# Altium project Ant_Robot_Controller.PrjPCB
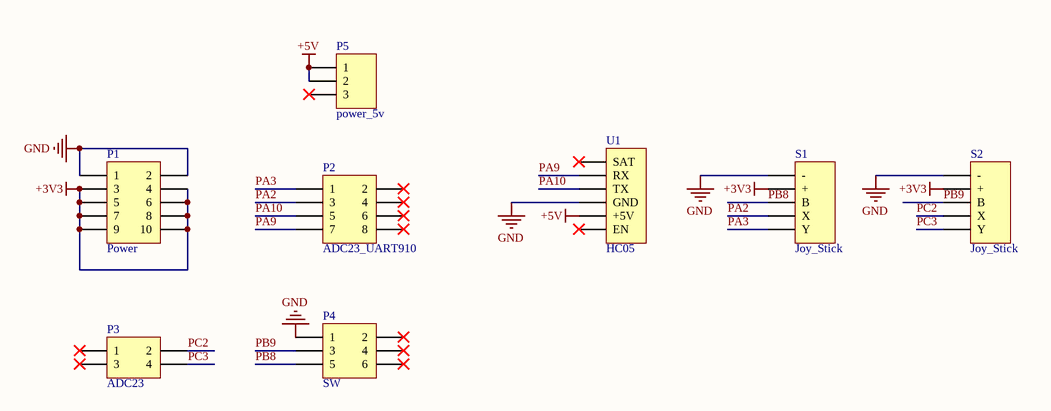
[diagram p0: Ant_Robot_Controller.SchDoc]
1 sheet, 8 parts. Net scope: global (net labels, ports and power ports of the same name join across sheets).
Board file: Ant_Robot_Controller.PcbDoc

## Sheet Ant_Robot_Controller.SchDoc
size A3

### Parts
P1  Power  [HDR2X5]
P2  ADC23_UART910  [HDR2X4]
P3  ADC23  [HDR2X2]
P4  SW  [HDR2X3]
P5  power_5v  [HDR1X3]
S1  Joy_Stick  [HDR1X5]
S2  Joy_Stick  [HDR1X5]
U1  HC05  [HDR1X6]

### Nets
+3V3: P1.3 P1.4 P1.5 P1.6 P1.7 P1.8 P1.9 P1.10 S1.2(+) S2.2(+)
+5V: P5.1 P5.2 U1.5(+5V)
GND: P1.1 P1.2 P4.1 S1.1(-) S2.1(-) U1.4(GND)
PA2: P2.3 S1.4(X)
PA3: P2.1 S1.5(Y)
PA9: P2.7 U1.2(RX)
PA10: P2.5 U1.3(TX)
PB8: P4.5 S1.3(B)
PB9: P4.3 S2.3(B)
PC2: P3.2 S2.4(X)
PC3: P3.4 S2.5(Y)

Not connected (* = marked no-connect by the designer): P2 2* 4* 6* 8*; P3 1* 3*; P4 2* 4* 6*; P5 3*; U1 1(SAT)* 6(EN)*

### Library data of the parts
P1 = Header 5X2: Header, 5-Pin, Dual row; LatestRevisionDate: 17-Jul-2002; LatestRevisionNote: Re-released for DXP Platform.; Publisher: Altium Limited
P2 = Header 4X2: Header, 4-Pin, Dual row; LatestRevisionDate: 17-Jul-2002; LatestRevisionNote: Re-released for DXP Platform.; Publisher: Altium Limited
P3 = Header 2X2: Header, 2-Pin, Dual row; LatestRevisionDate: 17-Jul-2002; LatestRevisionNote: Re-released for DXP Platform.; Publisher: Altium Limited
P4 = Header 3X2: Header, 3-Pin, Dual row; LatestRevisionDate: 17-Jul-2002; LatestRevisionNote: Re-released for DXP Platform.; Publisher: Altium Limited
P5 = Header 3: Header, 3-Pin; LatestRevisionDate: 17-Jul-2002; LatestRevisionNote: Re-released for DXP Platform.; Publisher: Altium Limited
S1 S2 = Header 5: Header, 5-Pin; LatestRevisionDate: 17-Jul-2002; LatestRevisionNote: Re-released for DXP Platform.; Publisher: Altium Limited
U1 = Header 6: Header, 6-Pin; LatestRevisionDate: 17-Jul-2002; LatestRevisionNote: Re-released for DXP Platform.; Publisher: Altium Limited